# Altium schematic sheet PWR_N2V5A.SchDoc: Power -2.5 V
size 297 x 209 mm; Author: P. Zdunek; DrawnBy: P. Zdunek; Organization: Altium Limited; Address1: L3, 12a Rodborough Rd; Address2: Frenchs Forest; Address3: NSW; Address4: Australia 2086; DocumentNumber: 37; SheetNumber: 37; SheetTotal: 37
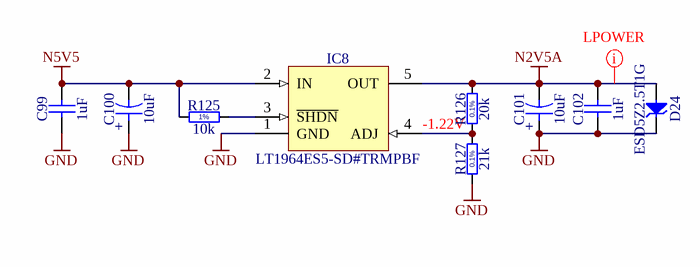
[diagram p0: PWR_N2V5A.SchDoc]

## Parts
C99  1uF  [CAPC1005X55N]
C100  10uF  [CAPMP3216X180N]
C101  10uF  [CAPMP3216X180N]
C102  1uF  [CAPC1005X55N]
D24  ESD5Z2.5T1G  [SODFL1608X70N]
IC8  LT1964ES5-SD#TRMPBF  [SOT95P280X100-5N]
R125  10k  [RESC1005X40N]
R126  20k  [RESC1608X55N]
R127  21k  [RESC1608X55N]

## Nets
GND: C99.1 C100.1 C101.1 C102.1 D24.1(C) IC8.1(GND) R127.1
N2V5A: C101.2 C102.2 D24.2(A) IC8.5(OUT) R126.2
N5V5: C99.2 C100.2 IC8.2(IN) R125.1
NetIC8_3: IC8.3(~{SHDN}) R125.2
NetIC8_4: IC8.4(ADJ) R126.1 R127.2

## Layout directives
net class Lpower; rule Routing Via Style [Pref Size = 0.6mm    Pref Hole Size = 0.3mm]; rule Width Constraint [Pref Width = 15mil    Min Width = 10mil    Max Width = 20mil]: N2V5A

## Notes on the sheet
- -1.22V
- Project
- Document
- Designer
- Drawn by
- Check.by
- File
- Last Mod.
- Print Date
- Sheet
- Size
- A4
- of
- Rev
- (in symbol CTE3216-18_10UF_16V_20%_AVX_TCJ) +
- (in symbol R0402_10K_1%_0.0625W_100PPM) 1%
- (in symbol R0603_20K_0.1%_0.063W_10PPM) 0.1%
- (in symbol R0603_21K_0.1%_0.063W_10PPM) 0.1%

## Library data of the parts
C99 C102 = CC0402_1UF_16V_10%_X5R: Non-polarised capacitor; Part Description: SMD Multilayer Chip Ceramic Capacitor; Manufacturer: GENERIC; Manufacturer1 Part Number: C1005X5R1C105KT; Voltage: 16V; TC: X5R; Tolerance: ±10%; Part Number: CC0402_1UF_16V_10%_X5R; Component Kind: Standard; Component Type: Standard; Pin Count: 2; Value: 1uF; Status: Preferred; Manufacturer Part Number: CC0402_1UF_16V_10%_X5R; Case: 0402; Mounted: Yes; Socket: No; SMD: Yes; Sense: No; Manufacturer1 Example: TDK; Manufacturer1 ComponentHeight: 0.55mm; HelpURL: \\cern.ch\dfs\Applications\Altium\Datasheets\CC0402_X5R_TDK_C.pdf; Author: CERN DEM JLC; CreateDate: 25/10/2012; LatestRevisionDate: 25/10/2012
C100 C101 = CTE3216-18_10UF_16V_20%_AVX_TCJ: Polarised capacitor; Part Description: ESR 0R200 Tantalum Solid Electrolytic Chip Capacitor with Conductive Polymer Electrode; Manufacturer: AVX; Manufacturer Part Number: TCJA106M016R0200; Voltage: 16V; Tolerance: ±20%; Part Number: CTE3216-18_10UF_16V_20%_AVX_TCJ; Component Kind: Standard; Component Type: Standard; Pin Count: 2; Value: 10uF; Status: Preferred; Case: A; Mounted: Yes; Socket: No; SMD: Yes; Sense: No; ComponentHeight: 1.8mm; HelpURL: \\cern.ch\dfs\Applications\Altium\Datasheets\CTE_AVX_TCJ.pdf; Author: CERN DEM JLC; CreateDate: 29.03.2012; LatestRevisionDate: 29.03.2012
D24 = ESD5Z2.5T1G: Zener Diode; Part Description: ESD Protection Diode; Manufacturer: ON SEMICONDUCTOR; Voltage: 2.5V; Power: 500mW; PressFit: No; Bonding: No; Part Number: ESD5Z2.5T1G; Component Kind: Standard; Component Type: Standard; Device: ESD5Z2.5T1G; PackageDescription: SODFL (SOD-523) Diode; 1.20mm W X 0.80mm L X 0.70mm H Body, IPC Medium Density; Manufacturer Part Number: ESD5Z2.5T1G; Pin Count: 2; Case: SOD-523; Mounted: Yes; Socket: No; SMD: Yes; Sense: No; ComponentHeight: 0.7mm; HelpURL: \\cern.ch\dfs\Applications\Altium\Datasheets\ESD5Z2.5T1G.pdf; Author: CERN DEM JLC; CreateDate: 10/07/2018; LatestRevisionDate: 10/07/2018
IC8 = LT1964ES5-SD#TRMPBF: 200mA, Low Noise, Low Dropout Negative Micropower Regulator; Part Description: -1.22V to -20V, 200mA, Low Noise, Low Dropout Negative Micropower Regulator; Manufacturer: LINEAR TECHNOLOGY; PressFit: No; Bonding: No; Part Number: LT1964ES5-SD#TRMPBF; Component Kind: Standard; Component Type: Standard; Device: LT1964ES5-SD#TRMPBF; PackageDescription: SOT23, 0.95mm pitch; 5 pin, 1.75mm W X 3.00mm L, IPC Medium Density; Manufacturer Part Number: LT1964ES5-SD#TRMPBF; Pin Count: 5; Case: SOT23-5; Mounted: Yes; Socket: No; SMD: Yes; Sense: No; ComponentHeight: 1mm; HelpURL: \\cern.ch\dfs\Applications\Altium\Datasheets\LT1964ES5-SD#TRMPBF.pdf; Author: CERN DEM JLC; CreateDate: 05.05.2009; LatestRevisionDate: 05.05.2009
R125 = R0402_10K_1%_0.0625W_100PPM: Resistor - 1%; Part Description: General Purpose Thick Film Chip Resistor; Manufacturer: GENERIC; Manufacturer1 Part Number: 232270671003L; PressFit: No; TC: ±100ppm/°C; Part Number: R0402_10K_1%_0.0625W_100PPM; Component Kind: Standard; Component Type: Standard; Pin Count: 2; Value: 10k; Status: Not Recommended; Manufacturer Part Number: R0402_10K_1%_0.0625W_100PPM; Case: 0402; Mounted: Yes; Sense: No; Socket: No; SMD: Yes; Manufacturer1 Example: YAGEO PHYCOMP; Manufacturer1 ComponentHeight: 0.4mm; HelpURL: \\cern.ch\dfs\Applications\Altium\Datasheets\R0402_Phycomp_RC0402.pdf; Author: CERN DEM JLC; CreateDate: 03-Dec-07; LatestRevisionDate: 17-Oct-12; Power: 0.0625W; Tolerance: ±1%
R126 = R0603_20K_0.1%_0.063W_10PPM: Resistor - 0.1%; Part Description: Thin Film Chip Resistor; Manufacturer: GENERIC; Manufacturer1 Part Number: RN73C1J20KBTDF; Power: 0.063W; TC: ±10ppm; PressFit: No; Part Number: R0603_20K_0.1%_0.063W_10PPM; Component Kind: Standard; Component Type: Standard; Pin Count: 2; Value: 20k; Status: Not Recommended; Tolerance: ±0.1%; Manufacturer Part Number: R0603_20K_0.1%_0.063W_10PPM; Case: 0603; Mounted: Yes; Sense: No; Socket: No; SMD: Yes; Manufacturer1 Example: TYCO HOLSWORTHY; Manufacturer1 ComponentHeight: 0.5mm; HelpURL: \\cern.ch\dfs\Applications\Altium\Datasheets\R0603_Tyco_RN73.pdf; Author: CERN DEM JLC; CreateDate: 03/12/2007; LatestRevisionDate: 13/03/2008
R127 = R0603_21K_0.1%_0.063W_10PPM: Resistor - 0.1%; Part Description: Thin Film Chip Resistor; Manufacturer: GENERIC; Manufacturer1 Part Number: RN73C1J21KBTDF; Power: 0.063W; TC: ±10ppm; PressFit: No; Part Number: R0603_21K_0.1%_0.063W_10PPM; Component Kind: Standard; Component Type: Standard; Pin Count: 2; Value: 21k; Status: Not Recommended; Tolerance: ±0.1%; Manufacturer Part Number: R0603_21K_0.1%_0.063W_10PPM; Case: 0603; Mounted: Yes; Sense: No; Socket: No; SMD: Yes; Manufacturer1 Example: TYCO HOLSWORTHY; Manufacturer1 ComponentHeight: 0.5mm; HelpURL: \\cern.ch\dfs\Applications\Altium\Datasheets\R0603_Tyco_RN73.pdf; Author: CERN DEM JLC; CreateDate: 03/12/2007; LatestRevisionDate: 13/03/2008